# EAGLE design SRX-CAN-plugboard (EAGLE 7.3.0)
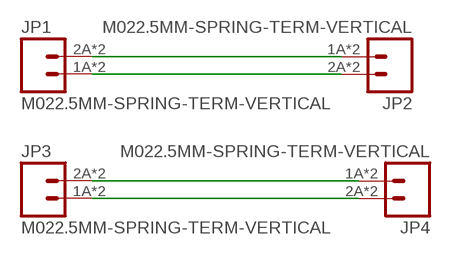
[diagram p0: schematic, sheet 1]

## Parts
JP1  M022.5MM-SPRING-TERM-VERTICAL  [1824740000-2X-VERTICAL-SPRING-TERMINAL]
JP2  M022.5MM-SPRING-TERM-VERTICAL  [1824740000-2X-VERTICAL-SPRING-TERMINAL]
JP3  M022.5MM-SPRING-TERM-VERTICAL  [1824740000-2X-VERTICAL-SPRING-TERMINAL]
JP4  M022.5MM-SPRING-TERM-VERTICAL  [1824740000-2X-VERTICAL-SPRING-TERMINAL]

## Nets
N$1: JP3.2A JP3.2B JP4.1A JP4.1B
N$6: JP3.1A JP3.1B JP4.2A JP4.2B
N$7: JP1.1A JP1.1B JP2.2A JP2.2B
N$8: JP1.2A JP1.2B JP2.1A JP2.1B

## Library data of the parts
JP1-JP4 = tekdemo:M02: Standard 2-pin 0.1" header. Use with - straight break away headers ( PRT-00116) - right angle break away headers (PRT-00553) - swiss pins (PRT-00743) - machine pins (PRT-00117) - female headers (PRT-00115) Molex polarized connector foot print use with: PRT-08233 with associated crimp pins and housings. 2.54_SCREWTERM for use with PRT-10571. 3.5mm Screw Terminal footprints for PRT-08084 5mm Screw Terminal footprints for use with PRT-08432

## Board
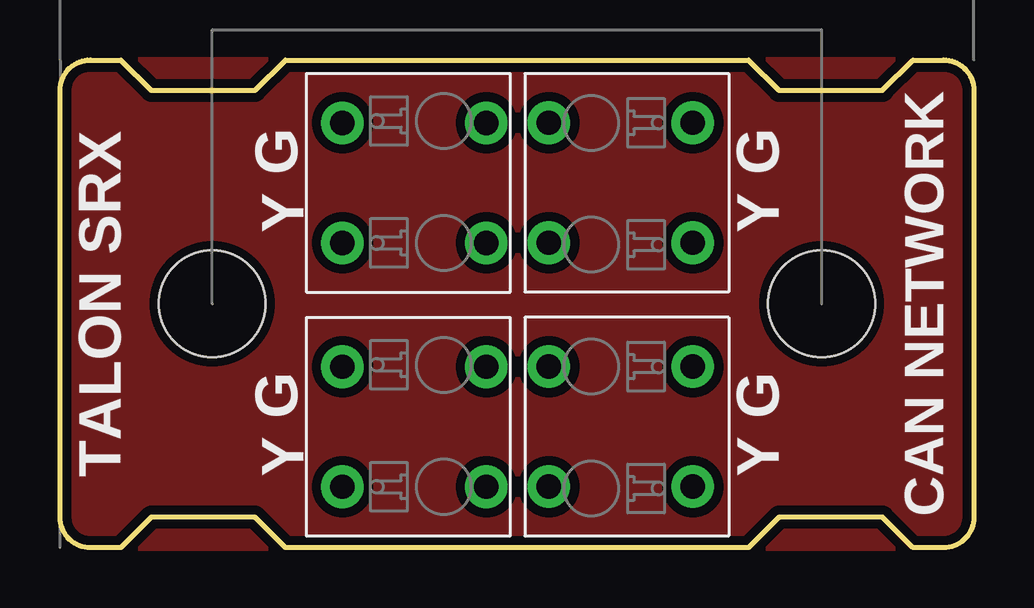
[diagram p1: board, top side]
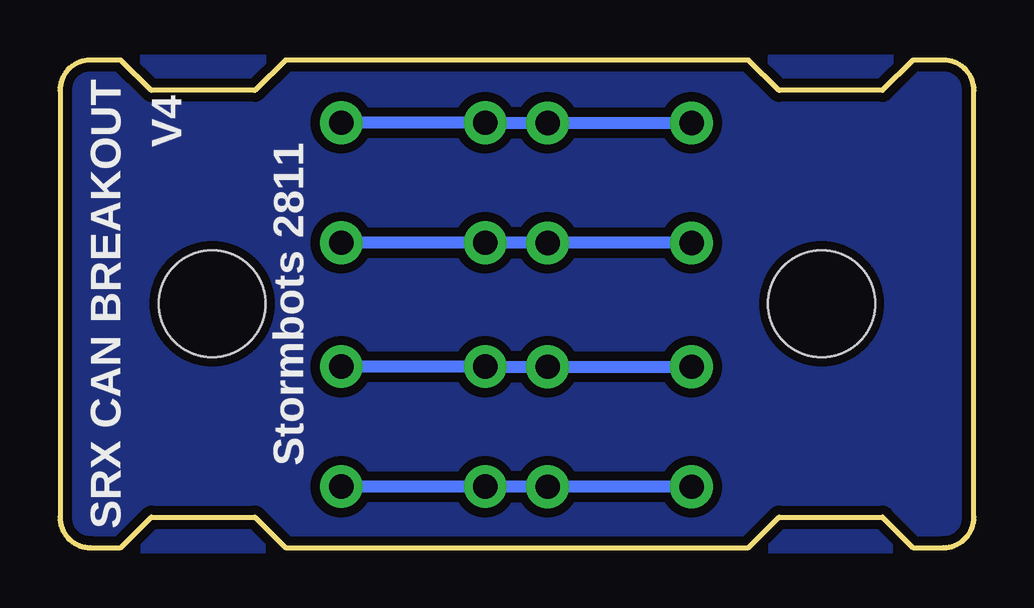
[diagram p2: board, bottom side, seen from below]

Size 38.1 x 20.32 mm. Coordinates in mm from the lower left corner, seen from the top.
Outline: 2.54,0 1.27,0 arc-90 0,1.27 0,19.05 arc-90 1.27,20.32 2.54,20.32 3.81,19.05 8.13,19.05 9.4,20.32 28.7,20.32 29.97,19.05 34.29,19.05 35.56,20.32 36.83,20.32 arc-90 38.1,19.05 38.1,1.27 arc-90 36.83,0 35.56,0 34.29,1.27 29.97,1.27 28.7,0 9.4,0 8.13,1.27 3.81,1.27 2.54,0
Copper layers (1*16): Top 0.0356mm / dielectric 1.5011mm / Bottom 0.0356mm
Design rules "LaenPCBOrder *": minimum track width 6mil, minimum drill 13mil, track to track 6mil, track to pad 6mil, pad to pad 6mil, via to via 6mil, smd to smd 0mil, copper to edge 15mil, drill to drill 6mil, minimum pad ring 7mil, minimum via ring 7mil, stop-mask expansion 4mil, vias tented up to drill 15mil, thermal gap 10mil
Holes 4.45 mm at 6.35,10.16 31.75,10.16
tKeepout: 2 lines

### Footprints (pad centres in the part's own frame; a part is rotated, then mirrored left to right if it is on the bottom)
1824740000-2X-VERTICAL-SPRING-TERMINAL = drill 1.016 pad 1.778: 1A 5,6.006; 1B 5,0.006; 2A 0,6.006; 2B 0,0.006

### Placement (x,y rotation side)
JP1  17.78,2.54 90 top
JP2  20.37,7.54 270 top
JP3  20.37,17.7 270 top
JP4  17.78,12.7 90 top

### Tracks (layer width: path | path; a pad name or v marks a point on that pad's centre or on a via)
N$1
  Bottom 0.508: JP4.1A JP4.1B JP3.2B JP3.2A
N$2
  pour Bottom (isolate 0.381): 0,20.32 0,0 38.1,0 38.1,20.32
N$3
  pour Top (isolate 0.381): 0,20.32 0,0 38.1,0 38.1,20.32
N$6
  Bottom 0.508: JP4.2A JP4.2B JP3.1B JP3.1A
N$7
  Bottom 0.508: JP1.1A JP1.1B JP2.2B JP2.2A
N$8
  Bottom 0.508: JP1.2A JP1.2B JP2.1B JP2.1A

### Text on the board
tPlace: G | G | Y | Y | TALON SRX | CAN NETWORK | G | G | Y | Y
bPlace: V4 | Stormbots 2811 | SRX CAN BREAKOUT